# Altium schematic sheet 08-multimodal-microcontroller-oscillators.SchDoc
size A; SheetNumber: 6; SheetTotal: 11
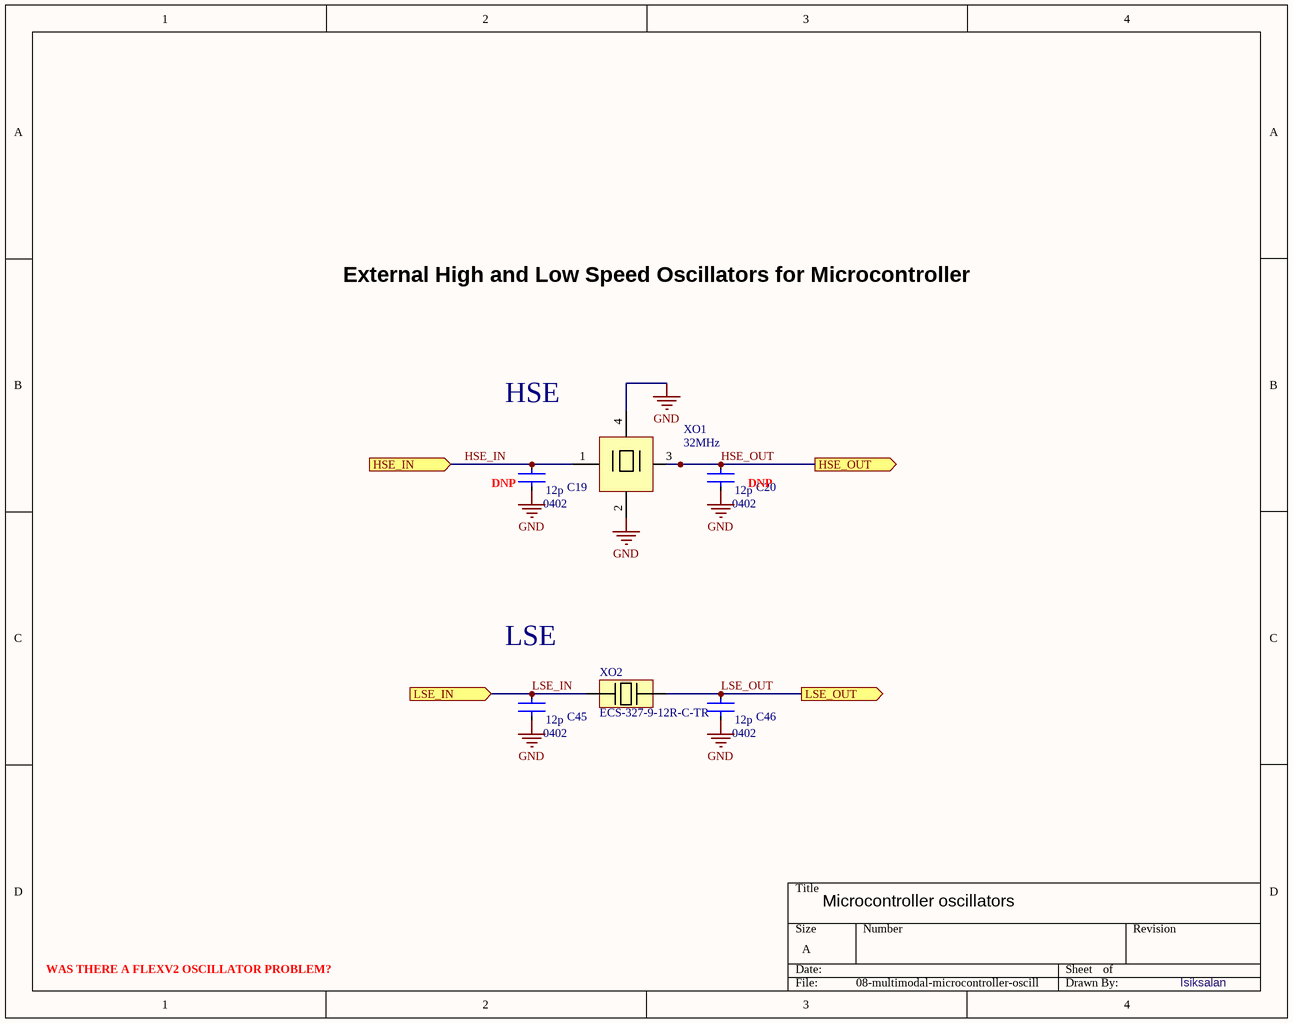
[diagram p0: 08-multimodal-microcontroller-oscillators.SchDoc]

## Parts
C19  CGA2B2C0G1H120J050BA  [CAPTDK0402]  (value not drawn)  (no BOM)
C20  CGA2B2C0G1H120J050BA  [CAPTDK0402]  (value not drawn)  (no BOM)
C45  CGA2B2C0G1H120J050BA  [CAPTDK0402]  (value not drawn)
C46  CGA2B2C0G1H120J050BA  [CAPTDK0402]  (value not drawn)
XO1  32MHz  [HSE-32MHZ]
XO2  ECS-327-9-12R-C-TR  [LSE-32K]

## Ports
HSE_IN (in, see 07-multimodal-microcontroller[7C]), HSE_OUT (out, see 07-multimodal-microcontroller[7D]), LSE_IN (in, see 07-multimodal-microcontroller[8C]), LSE_OUT (out, see 07-multimodal-microcontroller[8D])

## Nets
GND: C19.2 C20.2 C45.2 C46.2 XO1.2 XO1.4
HSE_IN: C19.1 XO1.1 ; port HSE_IN
HSE_OUT: C20.1 XO1.3 ; port HSE_OUT
LSE_IN: C45.1 XO2.1 ; port LSE_IN
LSE_OUT: C46.1 XO2.2 ; port LSE_OUT

## Notes on the sheet
- External High and Low Speed Oscillators for Microcontroller
- HSE
- (near C19) DNP
- (near C20) DNP
- LSE
- Microcontroller oscillators
- WAS THERE A FLEXV2 OSCILLATOR PROBLEM?
- Isiksalan
- (in symbol CGA2B2C0G1H120J050BA) 12p; 0402

## Library data of the parts
C19 C20 C45 C46 = CGA2B2C0G1H120J050BA: CAP CER 12PF 50V C0G 0402; Supplier 1: Digi-Key; Supplier Part Number 1: 445-5585-1-ND
XO1 = NX2016SA-32MHZ-EXS00A-CS06654: CRYSTAL 32MHZ 8PF 60R SMD; Manufacturer: NDK; Supplier 1: Digi-Key; Manufacturer Part Number: NX2016SA-32MHZ-EXS00A-CS06654; RoHS: No; Pricing 1: 1=0.58000, 10=0.48200, 50=0.43420, 100=0.38600, 500=0.36670, 1000=0.30880 (USD); Mount: Surface Mount; Case/Package: SMD/SMT; Min Operating Temperature: -40°C; Max Operating Temperature: 125°C; Packaging: Tape and Reel; Frequency: 32MHz; Load Capacitance: 8pF; ESR (Equivalent Series Resistance): 60R; Ratings: AEC-Q200; Supplier Part Number 1: 644-1373-1-ND
XO2 = ECS-327-9-12R-C-TR: Crystal 0.032768MHz ±10ppm (Tol) 9pF Flexural 70000Ohm Automotive 2-Pin Ultra Mini-CSMD T/R; Manufacturer: ECS International; Manufacturer Part Number: ECS-.327-9-12R-C-TR; Frequency: 32.768kHz; ESR (Equivalent Series Resistance): 70kR; Supplier 1: Digi-Key; RoHS: Yes; Stock 1: 152; Pricing 1: 1=0.79000, 10=0.65700, 50=0.59160, 100=0.52580, 500=0.49952, 1000=0.42064 (USD); Mount: Surface Mount; Case/Package: SMD/SMT; Min Operating Temperature: -40°C; Max Operating Temperature: 85°C; Packaging: Tape and Reel; Frequency Tolerance: 10ppm; Load Capacitance: 9pF; ComponentLink1URL: https://www.ecsxtal.com/store/pdf/ECX-12R.pdf?src-supplier=Digi-Key; ComponentLink1Description: https://www.ecsxtal.com/store/pdf/ECX-12R.pdf?src-supplier=Digi-Key; Supplier Part Number 1: XC2744CT-ND